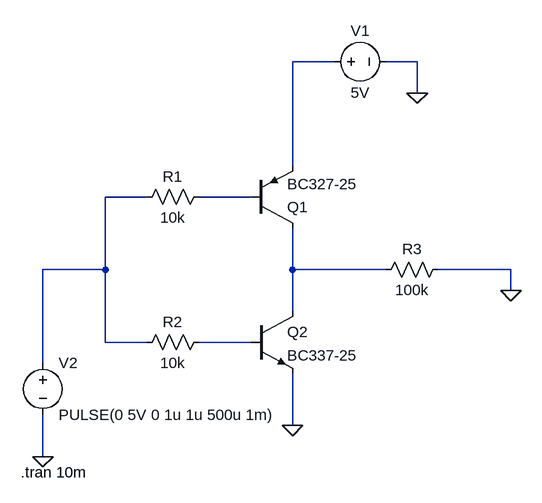
[diagram p0: schematic NotGate.asc]
NotGate.asc, the LTspice schematic file:
Version 4
SHEET 1 880 680
WIRE 192 -256 128 -256
WIRE 320 -256 272 -256
WIRE 320 -208 320 -256
WIRE 128 -96 128 -256
WIRE -96 -48 -160 -48
WIRE 64 -48 -16 -48
WIRE -160 64 -160 -48
WIRE -160 64 -256 64
WIRE 128 64 128 0
WIRE 272 64 128 64
WIRE 464 64 352 64
WIRE 464 96 464 64
WIRE 128 128 128 64
WIRE -160 176 -160 64
WIRE -96 176 -160 176
WIRE 64 176 -16 176
WIRE -256 208 -256 64
WIRE 128 304 128 224
WIRE -256 352 -256 288
FLAG 128 304 0
FLAG 320 -208 0
FLAG -256 352 0
FLAG 464 96 0
SYMBOL res 0 -64 R90
WINDOW 0 0 56 VBottom 2
WINDOW 3 32 56 VTop 2
SYMATTR InstName R1
SYMATTR Value 10k
SYMBOL res 0 160 R90
WINDOW 0 0 56 VBottom 2
WINDOW 3 32 56 VTop 2
SYMATTR InstName R2
SYMATTR Value 10k
SYMBOL voltage 176 -256 R270
WINDOW 0 32 56 VTop 2
WINDOW 3 -32 56 VBottom 2
WINDOW 123 0 0 Left 0
WINDOW 39 0 0 Left 0
SYMATTR InstName V1
SYMATTR Value 5V
SYMBOL voltage -256 192 R0
WINDOW 123 0 0 Left 0
WINDOW 39 0 0 Left 0
SYMATTR InstName V2
SYMATTR Value PULSE(0 5V 0 1u 1u 500u 1m)
SYMBOL res 368 48 R90
WINDOW 0 0 56 VBottom 2
WINDOW 3 32 56 VTop 2
SYMATTR InstName R3
SYMATTR Value 100k
SYMBOL pnp 64 0 M180
SYMATTR InstName Q1
SYMATTR Value BC327-25
SYMBOL npn 64 128 R0
SYMATTR InstName Q2
SYMATTR Value BC337-25
TEXT -290 376 Left 2 !.tran 10m

The netlist it stands for:
* NotGate.asc
R1 N003 N002 10k
R2 N005 N002 10k
V1 N001 0 5V
V2 N002 0 PULSE(0 5V 0 1u 1u 500u 1m)
R3 0 N004 100k
Q1 N004 N003 N001 0 BC327-25
Q2 N004 N005 0 0 BC337-25
.model NPN NPN
.model PNP PNP
.lib standard.bjt
.tran 10m
.backanno
.end